# Altium schematic sheet usb_converter.SchDoc
size A4; CheckedBy: TK; DrawnBy: MB,SB; SheetNumber: 2; SheetTotal: 2; ProjectName: Template
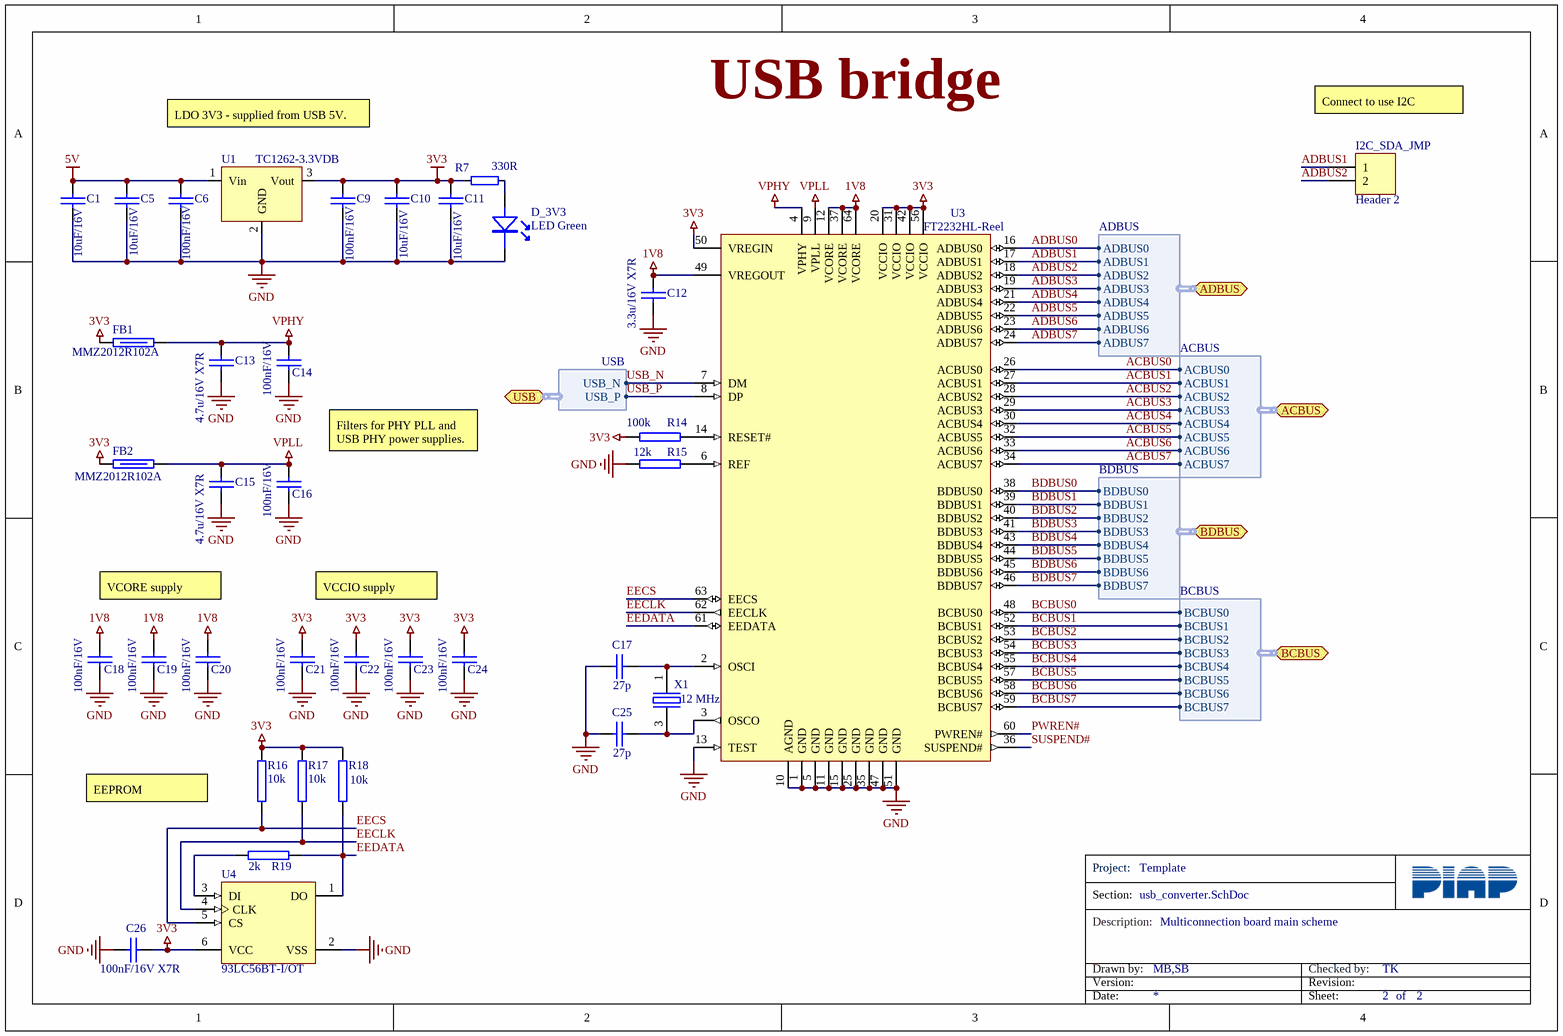
[diagram p0: usb_converter.SchDoc]

## Parts
C1  10uF/16V  [0603]
C5  10uF/16V  [0603]
C6  100nF/16V  [0603]
C9  100nF/16V  [0603]
C10  10uF/16V  [0603]
C11  10uF/16V  [0603]
C12  3.3u/16V X7R  [0805]
C13  4.7u/16V X7R  [0805]
C14  100nF/16V  [0603]
C15  4.7u/16V X7R  [0805]
C16  100nF/16V  [0603]
C17  27p  [0603]
C18  100nF/16V  [0603]
C19  100nF/16V  [0603]
C20  100nF/16V  [0603]
C21  100nF/16V  [0603]
C22  100nF/16V  [0603]
C23  100nF/16V  [0603]
C24  100nF/16V  [0603]
C25  27p  [0603]
C26  100nF/16V X7R  [0805]
D_3V3  LED Green  [LED SMD 0805]
FB1  MMZ2012R102A  [0805]
FB2  MMZ2012R102A  [0805]
I2C_SDA_JMP  Header 2  [HDR1X2]
R7  330R  [0603]
R14  100k  [0603]
R15  12k  [0603]
R16  10k  [0603]
R17  10k  [0603]
R18  10k  [0603]
R19  2k  [0603]
U1  TC1262-3.3VDB  [SOT223]
U3  FT2232HL-Reel  [LQFP-64_L]
U4  93LC56BT-I/OT  [SOT-23-OT6_L]
X1  12 MHz  [ABM8G]

## Ports
ACBUS (bidir, harness ACBUS), ADBUS (bidir, harness ADBUS), BCBUS (bidir, harness BCBUS), BDBUS (bidir, harness BDBUS), USB (bidir, harness USB)

## Harnesses
ADBUS: ADBUS0, ADBUS1, ADBUS2, ADBUS3, ADBUS4, ADBUS5, ADBUS6, ADBUS7
ACBUS: ACBUS0, ACBUS1, ACBUS2, ACBUS3, ACBUS4, ACBUS5, ACBUS6, ACBUS7
BDBUS: BDBUS0, BDBUS1, BDBUS2, BDBUS3, BDBUS4, BDBUS5, BDBUS6, BDBUS7
BCBUS: BCBUS0, BCBUS1, BCBUS2, BCBUS3, BCBUS4, BCBUS5, BCBUS6, BCBUS7
USB: USB_N, USB_P

## Nets
1V8: C12.1 C18.1 C19.1 C20.1 U3.12(VCORE) U3.37(VCORE) U3.49(VREGOUT) U3.64(VCORE)
3V3: C9.2 C10.2 C11.2 C21.1 C22.1 C23.1 C24.1 C26.2 FB1.2 FB2.2 R7.1 R14.2 R16.1 R17.1 R18.1 U1.3(Vout) U3.20(VCCIO) U3.31(VCCIO) U3.42(VCCIO) U3.50(VREGIN) U3.56(VCCIO) U4.6(VCC)
5V: C1.2 C5.2 C6.2 U1.1(Vin)
GND: C1.1 C5.1 C6.1 C9.1 C10.1 C11.1 C12.2 C13.2 C14.2 C15.2 C16.2 C17.2 C18.2 C19.2 C20.2 C21.2 C22.2 C23.2 C24.2 C25.2 C26.1 D_3V3.2 R15.2 U1.2(GND) U3.1(GND) U3.5(GND) U3.10(AGND) U3.11(GND) U3.13(TEST) U3.15(GND) U3.25(GND) U3.35(GND) U3.47(GND) U3.51(GND) U4.2(VSS)
VPHY: C13.1 C14.1 FB1.1 U3.4(VPHY)
VPLL: C15.1 C16.1 FB2.1 U3.9(VPLL)
ACBUS0: U3.26(ACBUS0) ; port ACBUS.ACBUS0
ACBUS1: U3.27(ACBUS1) ; port ACBUS.ACBUS1
ACBUS2: U3.28(ACBUS2) ; port ACBUS.ACBUS2
ACBUS3: U3.29(ACBUS3) ; port ACBUS.ACBUS3
ACBUS4: U3.30(ACBUS4) ; port ACBUS.ACBUS4
ACBUS5: U3.32(ACBUS5) ; port ACBUS.ACBUS5
ACBUS6: U3.33(ACBUS6) ; port ACBUS.ACBUS6
ACBUS7: U3.34(ACBUS7) ; port ACBUS.ACBUS7
ADBUS0: U3.16(ADBUS0) ; port ADBUS.ADBUS0
ADBUS1: I2C_SDA_JMP.1 U3.17(ADBUS1) ; port ADBUS.ADBUS1
ADBUS2: I2C_SDA_JMP.2 U3.18(ADBUS2) ; port ADBUS.ADBUS2
ADBUS3: U3.19(ADBUS3) ; port ADBUS.ADBUS3
ADBUS4: U3.21(ADBUS4) ; port ADBUS.ADBUS4
ADBUS5: U3.22(ADBUS5) ; port ADBUS.ADBUS5
ADBUS6: U3.23(ADBUS6) ; port ADBUS.ADBUS6
ADBUS7: U3.24(ADBUS7) ; port ADBUS.ADBUS7
BCBUS0: U3.48(BCBUS0) ; port BCBUS.BCBUS0
BCBUS1: U3.52(BCBUS1) ; port BCBUS.BCBUS1
BCBUS2: U3.53(BCBUS2) ; port BCBUS.BCBUS2
BCBUS3: U3.54(BCBUS3) ; port BCBUS.BCBUS3
BCBUS4: U3.55(BCBUS4) ; port BCBUS.BCBUS4
BCBUS5: U3.57(BCBUS5) ; port BCBUS.BCBUS5
BCBUS6: U3.58(BCBUS6) ; port BCBUS.BCBUS6
BCBUS7: U3.59(BCBUS7) ; port BCBUS.BCBUS7
BDBUS0: U3.38(BDBUS0) ; port BDBUS.BDBUS0
BDBUS1: U3.39(BDBUS1) ; port BDBUS.BDBUS1
BDBUS2: U3.40(BDBUS2) ; port BDBUS.BDBUS2
BDBUS3: U3.41(BDBUS3) ; port BDBUS.BDBUS3
BDBUS4: U3.43(BDBUS4) ; port BDBUS.BDBUS4
BDBUS5: U3.44(BDBUS5) ; port BDBUS.BDBUS5
BDBUS6: U3.45(BDBUS6) ; port BDBUS.BDBUS6
BDBUS7: U3.46(BDBUS7) ; port BDBUS.BDBUS7
EECLK: R17.2 U3.62(EECLK) U4.4(CLK)
EECS: R16.2 U3.63(EECS) U4.5(CS)
EEDATA: R18.2 R19.1 U3.61(EEDATA) U4.1(DO)
PWREN#: U3.60(PWREN#)
SUSPEND#: U3.36(SUSPEND#)
USB_N: U3.7(DM) ; port USB.USB_N
USB_P: U3.8(DP) ; port USB.USB_P
NetC17_1: C17.1 U3.2(OSCI) X1.1
NetC25_1: C25.1 U3.3(OSCO) X1.3
NetD_3V3_1: D_3V3.1 R7.2
NetR14_1: R14.1 U3.14(RESET#)
NetR15_1: R15.1 U3.6(REF)
NetR19_2: R19.2 U4.3(DI)

## Notes on the sheet
- USB bridge
- Connect to use I2C
- LDO 3V3 - supplied from USB 5V.
- Filters for PHY PLL and USB PHY power supplies.
- VCORE supply
- VCCIO supply
- EEPROM
- Multiconnection board main scheme
- Project:
- Section:
- Description:
- Drawn by:
- Version:
- Checked by:
- Revision:
- Date:
- Sheet:
- of

## Library data of the parts
C1 C5 C10 C11 = 100nF/16V/0603: 10uF,16V,0603,X5R, 10%; Supplier 1: Farnell; Dielectric: X5R; Tolerance: 10%
C6 C9 = 100nF/16V/0603: 100nF,16V,0603,,X7R; Tolerance: 10%; Supplier 1: Farnell; Dielectric: X7R
C12 = n100: Chip Capacitor 3.3u/16V X7R; Dostawca: Farnell; Tel/Fax: +48 12 4424724; email: AGrabowska@farnell.com; Opis: Chip Capacitor; Value: 3.3u/16V X7R
C13 C15 = n100: Chip Capacitor 4.7u/16V X7R; Dostawca: Farnell; Tel/Fax: +48 12 4424724; email: AGrabowska@farnell.com; Opis: Chip Capacitor; Value: 4.7u/16V X7R
C14 C16-C25 = n100: NS; Opis: Chip Capacitor; Dostawca: Farnell; Tel/Fax: +48 12 4424724; email: AGrabowska@farnell.com
  C14 C16 C18-C24: Value: 100nF/16V
  C17 C25: Value: 27p
C26 = n100: Chip Capacitor 100nF/16V X7R; Dostawca: Farnell; Tel/Fax: +48 12 4424724; email: AGrabowska@farnell.com; Opis: Chip Capacitor; Value: 100nF/16V X7R
D_3V3 = led_0805_green: LED Green 0805; Manufacturer Part Number: KP-2012SGD; HelpURL: O:\Protel\Library\Data Sheet\Optoelectronics\KP2012xxx.pdf; Supplier Part Number 1: KP-2012SGD; Supplier 1: TME
FB1 FB2 = MMZ2012R102A: Chip ferrite bead 500mA; Manufacturer Part Number: MMZ2012R102A; HelpURL: http://www.farnell.com/datasheets/84901.pdf; Supplier Part Number 1: 1669719; Supplier 1: Farnell
I2C_SDA_JMP = Header 2: Header, 2-Pin,  2.54mm; Dostawca: TME; Nr Katalogowy: 280370-2; Cena jednostkowa: 1,89; Value: Header 2
R7 = res_0603: Chip Resistor 0402; Tolerance: 1%
R14 = k100: Chip Resistor 100k O.25W; ID: CRCW0805100KFKEA; Nr Katalogowy: 1469860; Dostawca: Farnell; Dokładność: 1%; HelpURL: http://www.vishay.com/docs/20035/dcrcwe3.pdf; Value: 100k
R15 R19 = k100: Chip Resistor 0.25W; Dostawca: Farnell; Dokładność: 1%
  R15: Value: 12k
  R19: Value: 2k
R16-R18 = k100: Chip Resistor 0Ohm 0.25W; ID: CRCW0805100KFKEA; Nr Katalogowy: 1469860; Dostawca: Farnell; Dokładność: 1%; HelpURL: http://www.vishay.com/docs/20035/dcrcwe3.pdf; Value: 10k
U1 = TC1262-3.3VDB: 3-Terminal 3.3V 500mA Regulator; Manufacturer: MICROCHIP; HelpURL: O:\Protel\Library\Data Sheet\National\LM117,317.pdf; Manufacturer Part Number: TC1262-3.3VDB; Supplier Part Number 1: 1852183; Supplier 1: Farnell
U3 = CMP-0078-00023-2: Dual High Speed USB To Multipurpose UART/FIFO IC, LQFP-64, Tape and Reel; PackageVersion: 2010; DatasheetVersion: ver 2.10, Nov-2010; ComponentLink2Description: Datasheet; PackageReference: LQFP-64; PackageDescription: 64-Pin Thin Quad Flat Pack, 10 x 10 x 1.4 mm Body, 0.5 mm Pitch; ComponentLink1Description: Manufacturer URL; ComponentLink2URL: http://www.ftdichip.com/Support/Documents/DataSheets/ICs/DS_FT2232H.pdf; ComponentLink1URL: http://www.ftdichip.com/; RevisionNote: URLs added.
U4 = CMP-0162-00356-1: 2K, 128x16-bit, 2.5V Microwire Serial EEPROM, 6-Pin SOT-23, Industrial Temperature, Tape and Reel; DatasheetVersion: revF, May-2008; Code_IPC: SOT26A-6; PackageReference: SOT-23-OT6; PackageVersion: revBB, Aug-2009; PackageDescription: 6-Lead Plastic Small Outline Transistor (OT) [SOT-23]
X1 = ABM8G-12.000MHZ-4Y-T3: ABRACON  ABM8G-12.000MHZ  CRYSTAL, 12MHZ, 10PF, 3.2 X 2.5MM; Dostawca: Farnell; Nr katalogowy: 2467841; Cena jednostkowa: 3; url: http://pl.farnell.com/abracon/abm8g-16-000mhz-18-d2y-t/crystal-16mhz-18pf-3-2-x-2-5mm/dp/2467841; HelpURL: http://www.farnell.com/datasheets/1883677.pdf; Value: 12 MHz; ID: ABM8G-12.000MHZ; Manufacturer: ABRACON